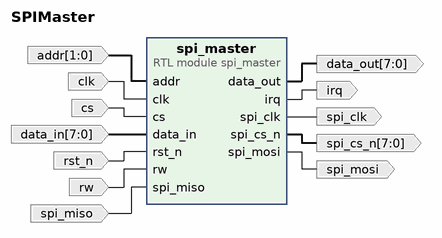
[diagram p0: block diagram of the top level]
# Vivado block design SPIMaster, xczu3eg-sbva484-1-i, Vivado 2020.2
create_bd_design SPIMaster

create_bd_port -dir I -from 1 -to 0 addr
create_bd_port -dir I -type clk clk
create_bd_port -dir I cs
create_bd_port -dir I -from 7 -to 0 data_in
create_bd_port -dir O -from 7 -to 0 data_out
create_bd_port -dir O -type intr irq
create_bd_port -dir I -type rst rst_n
create_bd_port -dir I rw
create_bd_port -dir O -type clk spi_clk
create_bd_port -dir O -from 7 -to 0 spi_cs_n
create_bd_port -dir I spi_miso
create_bd_port -dir O spi_mosi

create_bd_cell -type module -reference spi_master spi_master

# ---- connections ----

connect_bd_net -net addr_0_1 [get_bd_ports addr] [get_bd_pins spi_master/addr]
connect_bd_net -net clk_0_1 [get_bd_ports clk] [get_bd_pins spi_master/clk]
connect_bd_net -net cs_0_1 [get_bd_ports cs] [get_bd_pins spi_master/cs]
connect_bd_net -net data_in_0_1 [get_bd_ports data_in] [get_bd_pins spi_master/data_in]
connect_bd_net -net spi_master_0_data_out [get_bd_pins spi_master/data_out] [get_bd_ports data_out]
connect_bd_net -net spi_master_0_irq [get_bd_pins spi_master/irq] [get_bd_ports irq]
connect_bd_net -net rst_n_0_1 [get_bd_ports rst_n] [get_bd_pins spi_master/rst_n]
connect_bd_net -net rw_0_1 [get_bd_ports rw] [get_bd_pins spi_master/rw]
connect_bd_net -net spi_master_0_spi_clk [get_bd_pins spi_master/spi_clk] [get_bd_ports spi_clk]
connect_bd_net -net spi_master_0_spi_cs_n [get_bd_pins spi_master/spi_cs_n] [get_bd_ports spi_cs_n]
connect_bd_net -net spi_miso_0_1 [get_bd_ports spi_miso] [get_bd_pins spi_master/spi_miso]
connect_bd_net -net spi_master_0_spi_mosi [get_bd_pins spi_master/spi_mosi] [get_bd_ports spi_mosi]

validate_bd_design
save_bd_design
